# Altium schematic sheet Placa teste.SchDoc
size A4
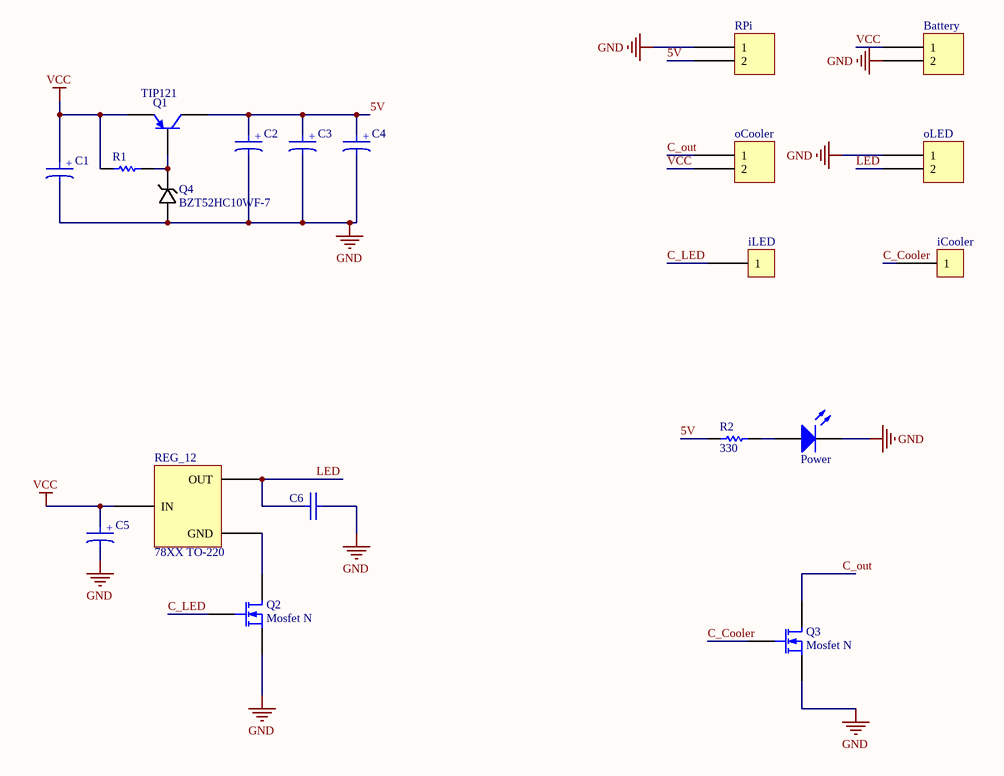
[diagram p0: Placa teste.SchDoc]

## Parts
Battery  *  [XT90]  (value not drawn)
C1  *  [Eletrolytic Capacitor 5x5mm]  (value not drawn)
C2  *  [Eletrolytic Capacitor 5x5mm]  (value not drawn)
C3  *  [Eletrolytic Capacitor 5x5mm]  (value not drawn)
C4  *  [Eletrolytic Capacitor 5x5mm]  (value not drawn)
C5  *  [Eletrolytic Capacitor 5x5mm]  (value not drawn)
C6  *  [SMD Capacitor]  (value not drawn)
iCooler  *  [HEADER 1X1 8.5MM]  (value not drawn)
iLED  *  [HEADER 1X1 8.5MM]  (value not drawn)
oCooler  *  [KK2]  (value not drawn)
oLED  *  [KK2]  (value not drawn)
Power  LED 5mm THT  [LED THT]  (value not drawn)
Q1  TIP121  [TO-92A]
Q2  Mosfet N  [TO-220]
Q3  Mosfet N  [TO-220]
Q4  BZT52HC10WF-7  [SOD123]
R1  Resistor THT  [RESISTOR THT 5mm]  (value not drawn)
R2  value 330  [RESISTOR THT 5mm]  (hidden comment: Resistor THT)
REG_12  78XX TO-220  [TO-220]
RPi  *  [KK2]  (value not drawn)

## Nets
GND: Battery.2 C1.2 C2.2 C3.2 C4.2 C5.2 C6.1 oLED.1 Power.2(K) Q2.1(S) Q3.1(S) Q4.A RPi.1
VCC: Battery.1 C1.1 C5.1 oCooler.2 Q1.1(E) R1.1 REG_12.1(IN)
5V: C2.1 C3.1 C4.1 Q1.3(C) R2.1 RPi.2
C_Cooler: iCooler.1 Q3.2(G)
C_LED: iLED.1 Q2.2(G)
C_out: oCooler.1 Q3.3(D)
LED: C6.2 oLED.2 REG_12.3(OUT)
NetPower_1: Power.1(A) R2.2
NetQ1_2: Q1.2(B) Q4.K R1.2
NetQ2_3: Q2.3(D) REG_12.2(GND)

## Notes on the sheet
- (in symbol Electrolytic Capacitor 0.33uF) +

## Library data of the parts
Battery = XT90
C1-C5 = Electrolytic Capacitor 0.33uF
C6 = Capacitor SMD 0805
iCooler iLED = Male Pin Head 1x1
oCooler oLED RPi = KK2: KK Connector, 2 ways
Q1 = 2N3906: PNP General Purpose Amplifier; Published: 8-Jun-2000; LatestRevisionDate: 15-Jan-2003; LatestRevisionNote: PCB Footprint 'BCY-W3/D4.7' replaced; DatasheetVersion: 1997; PackageVersion: Sep-1998; PackageReference: TO-92A; Publisher: Altium Limited; PackageDescription: TO, Flat Index; 3 In-Line, Axial Leads; Body Dia. 4.5mm; Leads 0.51 x 0.48 mm (max); ComponentLink1Description: Manufacturer Link; ComponentLink1URL: http://www.fairchildsemi.com/; ComponentLink2Description: Datasheet; ComponentLink2URL: http://www.fairchildsemi.com/ds/2N%2F2N3906.pdf
Q2 Q3 = Mosfet N: Model: IRF3205
Q4 = BZT52HC10WF-7: Diode Zener 10.6V 375 mW AEC-Q101
Power = LED 5mm THT: Color: *
R1 R2 = Resistor THT
  R1: Value: ?